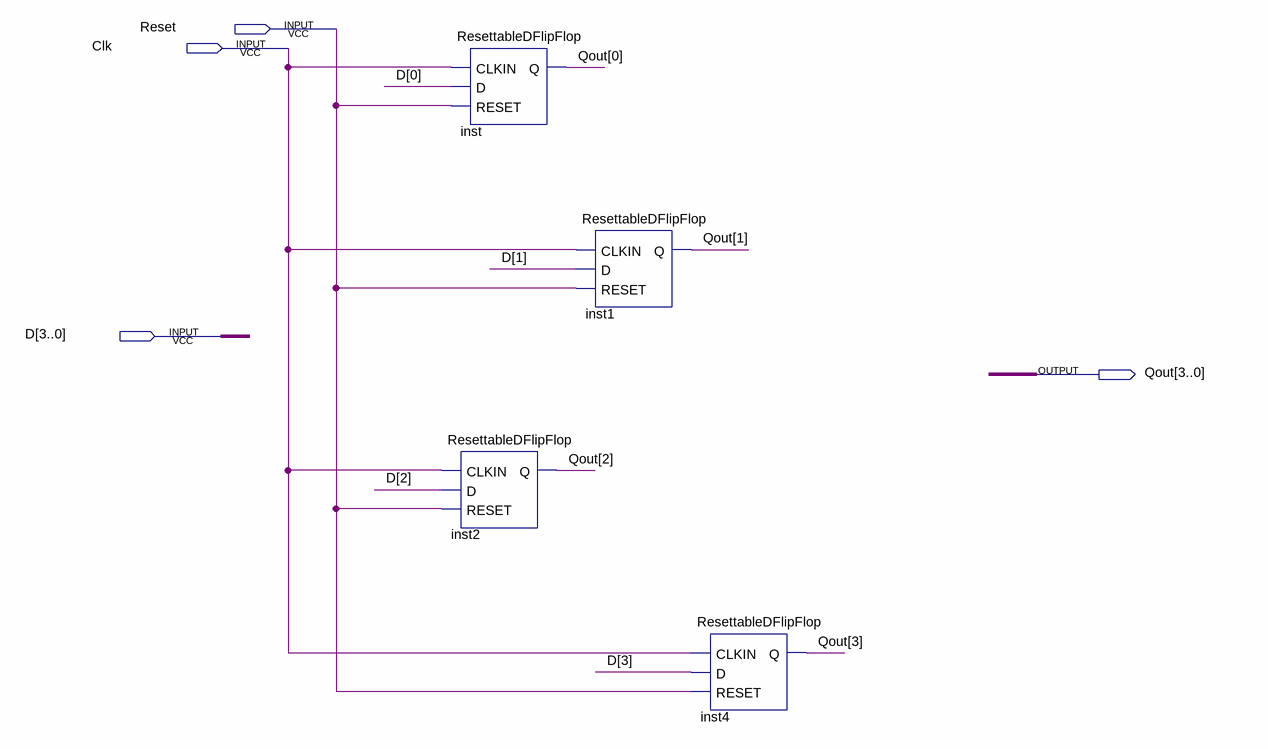
[diagram p0: schematic sheet]
// Quartus schematic FourBitRegister.bdf as structural Verilog: 4 symbols, 4 pins
module FourBitRegister (
  input  Reset,
  input  Clk,
  input  [3:0] D,
  output [3:0] Qout
);

  ResettableDFlipFlop inst (.CLKIN(Clk), .D(D[0]), .RESET(Reset), .Q(Qout[0]));
  ResettableDFlipFlop inst2 (.CLKIN(Clk), .D(D[2]), .RESET(Reset), .Q(Qout[2]));
  ResettableDFlipFlop inst1 (.CLKIN(Clk), .D(D[1]), .RESET(Reset), .Q(Qout[1]));
  ResettableDFlipFlop inst4 (.CLKIN(Clk), .D(D[3]), .RESET(Reset), .Q(Qout[3]));
endmodule
